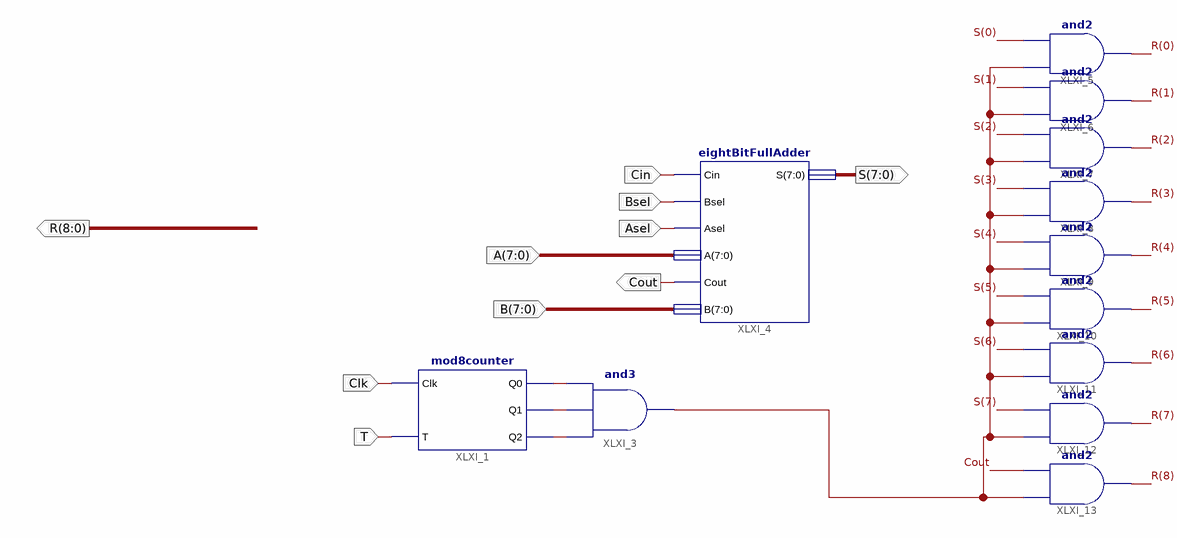
[diagram p0: schematic sheet 1]
// Xilinx ISE schematic first_e.sch (spartan3) as structural Verilog: 12 symbols, 10 ports
module first_e (
  input  Clk,
  input  T,
  input  [7:0] A,
  input  [7:0] B,
  input  Bsel,
  input  Asel,
  input  Cin,
  output Cout,
  output [7:0] S,
  output [8:0] R
);

  wire XLXN_1, XLXN_2, XLXN_3, XLXN_42;

  mod8counter XLXI_1 (.Clk(Clk), .T(T), .Q0(XLXN_3), .Q1(XLXN_2), .Q2(XLXN_1));
  and XLXI_3 (XLXN_42, XLXN_1, XLXN_2, XLXN_3);
  eightBitFullAdder XLXI_4 (.Cin(Cin), .Bsel(Bsel), .Asel(Asel), .A(A), .B(B), .Cout(Cout), .S(S));
  and XLXI_5 (R[0], XLXN_42, S[0]);
  and XLXI_6 (R[1], XLXN_42, S[1]);
  and XLXI_7 (R[2], XLXN_42, S[2]);
  and XLXI_8 (R[3], XLXN_42, S[3]);
  and XLXI_9 (R[4], XLXN_42, S[4]);
  and XLXI_10 (R[5], XLXN_42, S[5]);
  and XLXI_11 (R[6], XLXN_42, S[6]);
  and XLXI_12 (R[7], XLXN_42, S[7]);
  and XLXI_13 (R[8], XLXN_42, Cout);
endmodule
